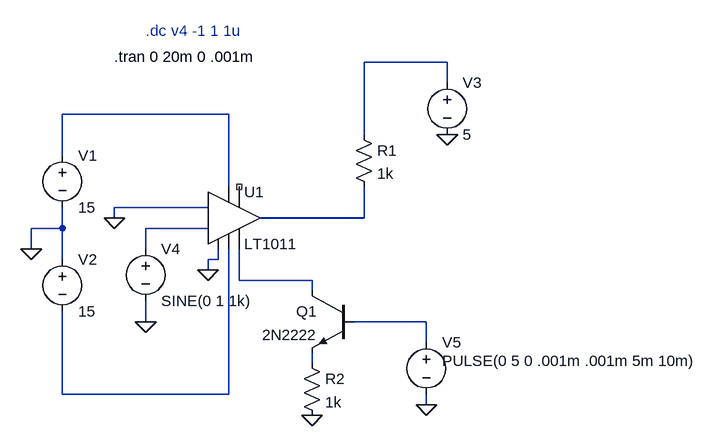
[diagram p0: schematic comparadorLt1011_4.asc]
comparadorLt1011_4.asc, the LTspice schematic file:
Version 4
SHEET 1 1044 680
WIRE 528 -80 400 -80
WIRE 528 -48 528 -80
WIRE 192 0 -64 0
WIRE 400 32 400 -80
WIRE -64 64 -64 0
WIRE 192 112 192 0
WIRE 160 144 16 144
WIRE 16 160 16 144
WIRE 400 160 400 112
WIRE 400 160 240 160
WIRE -64 176 -64 144
WIRE -64 176 -112 176
WIRE 160 176 64 176
WIRE -112 208 -112 176
WIRE 64 208 64 176
WIRE -64 224 -64 176
WIRE 176 224 176 208
WIRE 176 224 160 224
WIRE 160 240 160 224
WIRE 208 256 208 208
WIRE 320 256 208 256
WIRE 320 272 320 256
WIRE 64 320 64 288
WIRE 496 320 384 320
WIRE 496 352 496 320
WIRE 320 384 320 368
WIRE -64 432 -64 304
WIRE 192 432 192 208
WIRE 192 432 -64 432
WIRE 496 448 496 432
FLAG -112 208 0
FLAG 160 240 0
FLAG 528 32 0
FLAG 64 320 0
FLAG 16 160 0
FLAG 320 464 0
FLAG 496 448 0
SYMBOL Comparators\\LT1011 192 160 R0
SYMATTR InstName U1
SYMBOL voltage -64 48 R0
WINDOW 123 0 0 Left 0
WINDOW 39 0 0 Left 0
SYMATTR InstName V1
SYMATTR Value 15
SYMBOL voltage -64 208 R0
WINDOW 123 0 0 Left 0
WINDOW 39 0 0 Left 0
SYMATTR InstName V2
SYMATTR Value 15
SYMBOL res 384 16 R0
SYMATTR InstName R1
SYMATTR Value 1k
SYMBOL voltage 528 -64 R0
WINDOW 123 0 0 Left 0
WINDOW 39 0 0 Left 0
SYMATTR InstName V3
SYMATTR Value 5
SYMBOL voltage 64 192 R0
WINDOW 123 0 0 Left 0
WINDOW 39 0 0 Left 0
SYMATTR InstName V4
SYMATTR Value SINE(0 1 1k)
SYMBOL npn 384 272 M0
SYMATTR InstName Q1
SYMATTR Value 2N2222
SYMBOL res 304 368 R0
SYMATTR InstName R2
SYMATTR Value 1k
SYMBOL voltage 496 336 R0
WINDOW 3 24 44 Left 2
WINDOW 123 0 0 Left 0
WINDOW 39 0 0 Left 0
SYMATTR Value PULSE(0 5 0 .001m .001m 5m 10m)
SYMATTR InstName V5
TEXT 64 -128 Left 2 ;.dc v4 -1 1 1u
TEXT 16 -88 Left 2 !.tran 0 20m 0 .001m

The netlist it stands for:
* comparadorLt1011_4.asc
XU1 0 N004 0 N008 NC_01 N005 N003 N002 LT1011
V1 N002 0 15
V2 0 N008 15
R1 N001 N003 1k
V3 N001 0 5
V4 N004 0 SINE(0 1 1k)
Q1 N005 N006 N007 0 2N2222
R2 N007 0 1k
V5 N006 0 PULSE(0 5 0 .001m .001m 5m 10m)
.model NPN NPN
.model PNP PNP
.lib standard.bjt
* .dc v4 -1 1 1u
.tran 0 20m 0 .001m
.lib LTC1.lib
.backanno
.end